# Altium schematic sheet face_board.SchDoc
size A3
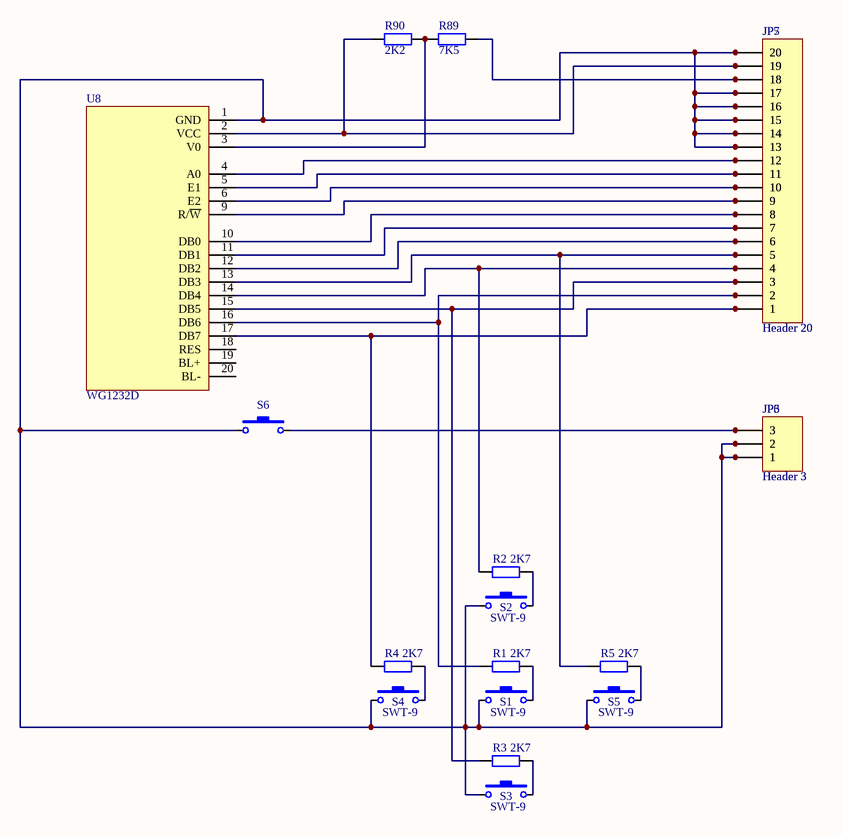
[diagram p0: face_board.SchDoc]

## Parts
JP3  Header 3  [HDR1X3]
JP5  Header 20  [HDR1X20]
JP6  Header 3  [HDR1X3]
JP7  Header 20  [HDR1X20]
R1  2K7  [_1206]
R2  2K7  [_1206]
R3  2K7  [_1206]
R4  2K7  [_1206]
R5  2K7  [_1206]
R89  7K5  [_1206]
R90  2K2  [_1206]
S1  SWT-9  [SWT-9]
S2  SWT-9  [SWT-9]
S3  SWT-9  [SWT-9]
S4  SWT-9  [SWT-9]
S5  SWT-9  [SWT-9]
S6  SWT-6  [SWT-6]  (value not drawn)
U8  WG1232D  [WG1232D]

## Nets
NetJP3_1: JP3.1 JP3.2 JP5.13 JP5.14 JP5.15 JP5.16 JP5.17 JP5.20 JP6.1 JP6.2 JP7.13 JP7.14 JP7.15 JP7.16 JP7.17 JP7.20 S1.1 S2.1 S3.1 S4.1 S5.1 S6.1 U8.1(GND)
NetJP3_3: JP3.3 JP6.3 S6.2
NetJP5_1: JP5.1 JP7.1 R4.2 U8.17(DB7)
NetJP5_2: JP5.2 JP7.2 R1.2 U8.16(DB6)
NetJP5_3: JP5.3 JP7.3 R3.2 U8.15(DB5)
NetJP5_4: JP5.4 JP7.4 R2.2 U8.14(DB4)
NetJP5_5: JP5.5 JP7.5 R5.2 U8.13(DB3)
NetJP5_6: JP5.6 JP7.6 U8.12(DB2)
NetJP5_7: JP5.7 JP7.7 U8.11(DB1)
NetJP5_8: JP5.8 JP7.8 U8.10(DB0)
NetJP5_9: JP5.9 JP7.9 U8.9(R/~{W})
NetJP5_10: JP5.10 JP7.10 U8.6(E2)
NetJP5_11: JP5.11 JP7.11 U8.5(E1)
NetJP5_12: JP5.12 JP7.12 U8.4(A0)
NetJP5_18: JP5.18 JP7.18 R89.1
NetJP5_19: JP5.19 JP7.19 R90.2 U8.2(VCC)
NetR1_1: R1.1 S1.2
NetR2_1: R2.1 S2.2
NetR3_1: R3.1 S3.2
NetR4_1: R4.1 S4.2
NetR5_1: R5.1 S5.2
NetR89_2: R89.2 R90.1 U8.3(V0)

Not connected (* = marked no-connect by the designer): U8 18(RES) 19(BL+) 20(BL-)

## Library data of the parts
JP3 JP6 = Header 3: Header, 3-Pin; Manufacturer: Generic Components; Class I: Connector; Revision: July-2002: Re-released for DXP Platform.; Publisher: Altium Limited
JP5 JP7 = Header 20: Header, 20-Pin; Manufacturer: Generic Components; Class I: Connector; Revision: July-2002: Re-released for DXP Platform.; Publisher: Altium Limited
R1-R5 R89 R90 = Res2: Resistor; Manufacturer: Generic Components; Class I: Passive; Rule: Undefined; Published: 8-Jun-2000; Revision: July-2002: Re-released for DXP Platform.; Publisher: Altium Limited; Class II: Resistor
  R1-R5: Value: 2K7
  R89: Value: 7K5
  R90: Value: 2K2
S1-S5 = SWT-9: Switch; Manufacturer: Generic Components; Published: 24-Mar-1999; Revision: July-2002: Re-released for DXP Platform.; Publisher: Altium Limited
S6 = SWT-9: Button; Manufacturer: Generic Components; Published: 24-Mar-1999; Revision: July-2002: Re-released for DXP Platform.; Publisher: Altium Limited; Value: SWT-6
U8 = WG1232D_pereh